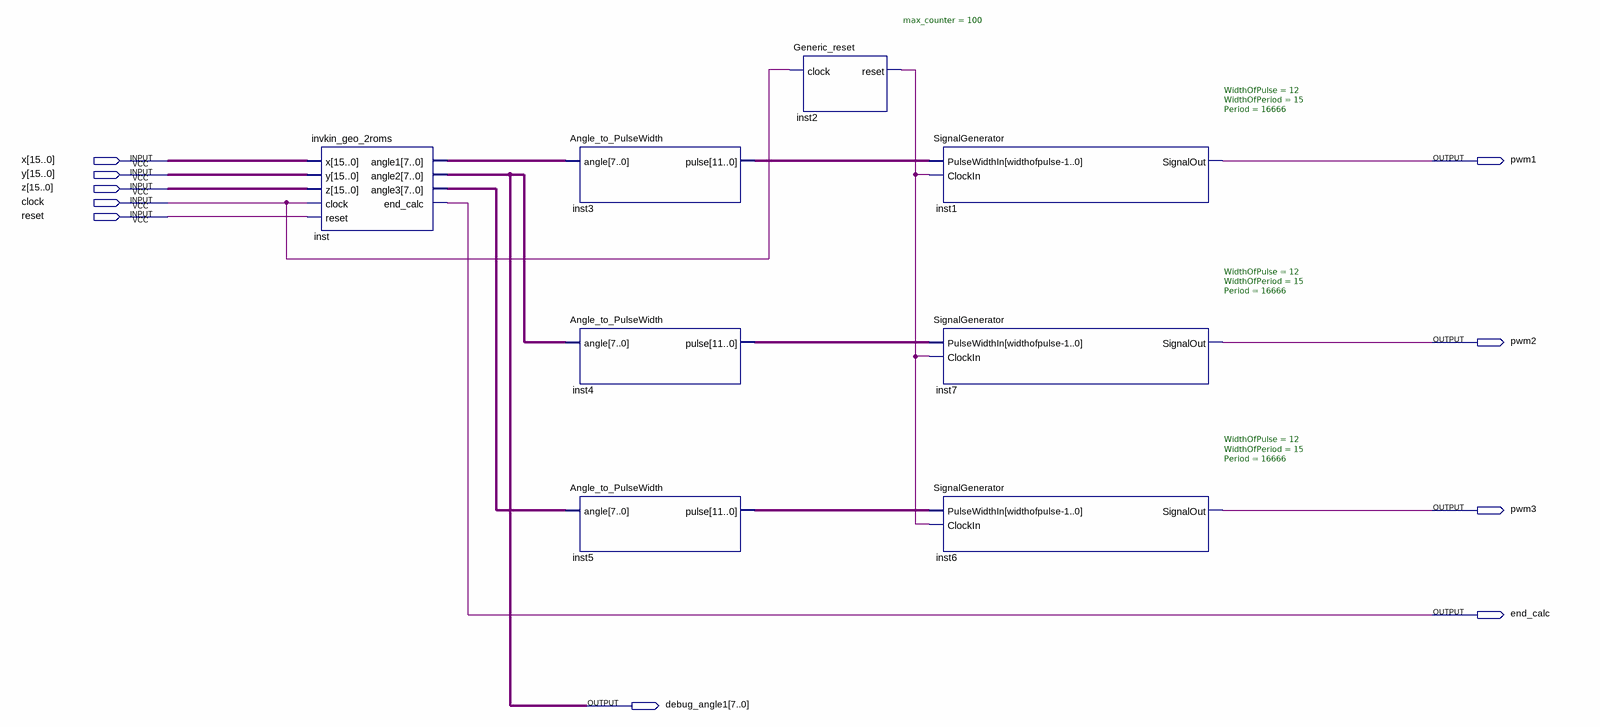
[diagram p0: schematic sheet]
// Quartus schematic leg_new.bdf as structural Verilog: 8 symbols, 10 pins
module leg_new (
  input  [15:0] x,
  input  [15:0] y,
  input  [15:0] z,
  input  clock,
  input  reset,
  output pwm1,
  output pwm2,
  output pwm3,
  output end_calc,
  output [7:0] debug_angle1
);

  wire inst2_reset;
  wire [7:0] inst_angle1, inst_angle3;
  wire [11:0] inst3_pulse, inst4_pulse, inst5_pulse;

  invkin_geo_2roms inst (
    .x(x), .y(y), .z(z), .clock(clock), .reset(reset), .angle1(inst_angle1), .angle2(debug_angle1),
    .angle3(inst_angle3), .end_calc(end_calc));
  Angle_to_PulseWidth inst3 (.angle(inst_angle1), .pulse(inst3_pulse));
  Angle_to_PulseWidth inst4 (.angle(debug_angle1), .pulse(inst4_pulse));
  Angle_to_PulseWidth inst5 (.angle(inst_angle3), .pulse(inst5_pulse));
  Generic_reset #(.max_counter(100)) inst2 (.clock(clock), .reset(inst2_reset));
  SignalGenerator #(.WidthOfPulse(12), .WidthOfPeriod(15), .Period(16666)) inst1 (
    .PulseWidthIn(inst3_pulse), .ClockIn(inst2_reset), .SignalOut(pwm1));
  SignalGenerator #(.WidthOfPulse(12), .WidthOfPeriod(15), .Period(16666)) inst7 (
    .PulseWidthIn(inst4_pulse), .ClockIn(inst2_reset), .SignalOut(pwm2));
  SignalGenerator #(.WidthOfPulse(12), .WidthOfPeriod(15), .Period(16666)) inst6 (
    .PulseWidthIn(inst5_pulse), .ClockIn(inst2_reset), .SignalOut(pwm3));
endmodule
